# Altium schematic sheet 计算器.SchDoc
size A4
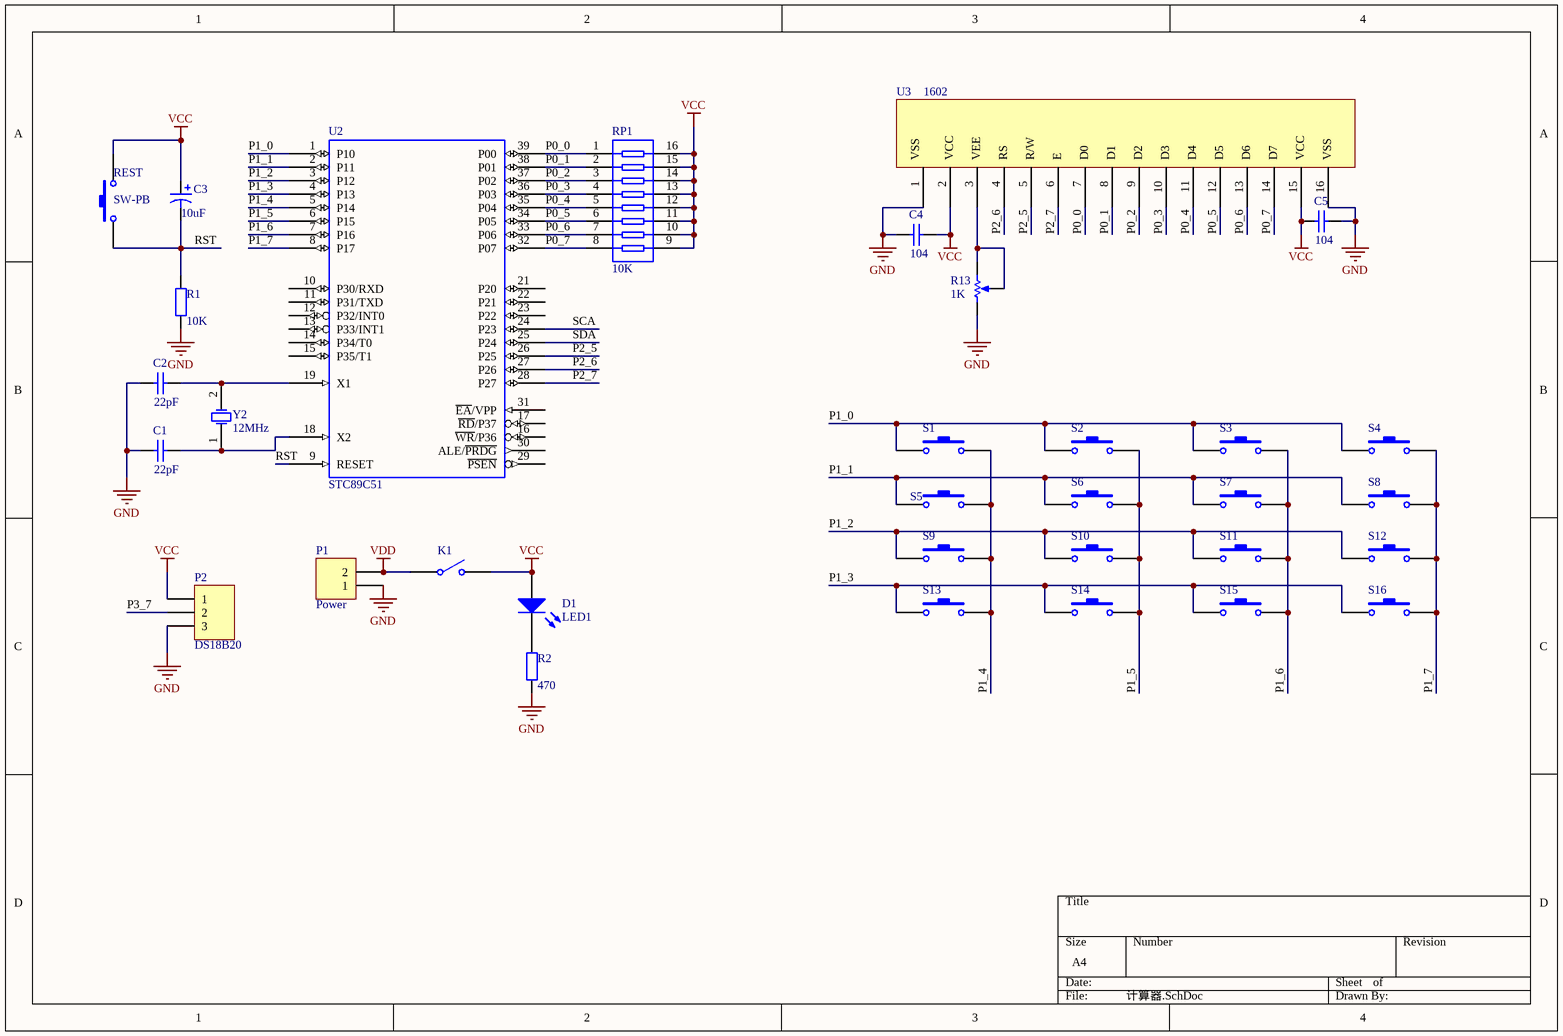
[diagram p0: 计算器.SchDoc]

## Parts
C1  value 22pF  [RAD-0.3]
C2  value 22pF  [RAD-0.3]
C3  value 10uF  [RB7.6-15]
C4  value 104  [RAD-0.3]
C5  value 104  [RAD-0.3]
D1  LED1  [LED-1]
K1  (no value)  [SPST-2]
P1  Power  [HDR1X2]
P2  DS18B20  [HDR1X3]
R1  value 10K  [AXIAL-0.4]
R2  value 470  [AXIAL-0.4]
R13  value 1K  [VR5]
REST  SW-PB  [SPST-2]
RP1  10K  [DIP16]
S1  (no value)  [SPST-2]
S2  (no value)  [SPST-2]
S3  (no value)  [SPST-2]
S4  (no value)  [SPST-2]
S5  (no value)  [SPST-2]
S6  (no value)  [SPST-2]
S7  (no value)  [SPST-2]
S8  (no value)  [SPST-2]
S9  (no value)  [SPST-2]
S10  (no value)  [SPST-2]
S11  (no value)  [SPST-2]
S12  (no value)  [SPST-2]
S13  (no value)  [SPST-2]
S14  (no value)  [SPST-2]
S15  (no value)  [SPST-2]
S16  (no value)  [SPST-2]
U2  STC89C51
U3  1602
Y2  12MHz  [BCY-W2/D3.1]

## Nets
GND: C1.1 C2.1 C4.1 C5.2 P1.1 P2.3 R1.1 R2.1 R13.1(TOP) U2.20(GND) U3.1 U3.16
VCC: C3.1 C4.2 C5.1 D1.1(A) K1.2(NO) P2.1 REST.2 RP1.9 RP1.10 RP1.11 RP1.12 RP1.13 RP1.14 RP1.15 RP1.16 U2.40(VCC) U3.2 U3.15
VDD: K1.1(COMMON) P1.2
P0_0: RP1.1 U2.39(P00) U3.7
P0_1: RP1.2 U2.38(P01) U3.8
P0_2: RP1.3 U2.37(P02) U3.9
P0_3: RP1.4 U2.36(P03) U3.10
P0_4: RP1.5 U2.35(P04) U3.11
P0_5: RP1.6 U2.34(P05) U3.12
P0_6: RP1.7 U2.33(P06)
P0_7: RP1.8 U2.32(P07)
P1_0: S1.1 S2.1 S3.1 S4.1 U2.1(P10)
P1_1: S5.1 S6.1 S7.1 S8.1 U2.2(P11)
P1_2: S9.1 S10.1 S11.1 S12.1 U2.3(P12)
P1_3: S13.1 S14.1 S15.1 S16.1 U2.4(P13)
P1_4: S1.2 S5.2 S9.2 S13.2 U2.5(P14)
P1_5: S2.2 S6.2 S10.2 S14.2 U2.6(P15)
P1_6: S3.2 S7.2 S11.2 S15.2 U2.7(P16)
P1_7: S4.2 S8.2 S12.2 S16.2 U2.8(P17)
P2_5: U2.26(P25)
P2_6: U2.27(P26)
P2_7: U2.28(P27)
P3_7: P2.2
RST: C3.2 R1.2 REST.1 U2.9(RESET)
SCA: U2.24(P23)
SDA: U2.25(P24)
NetC1_2: C1.2 U2.18(X2) Y2.1(OSC1)
NetC2_2: C2.2 U2.19(X1) Y2.2(OSC2)
NetD1_2: D1.2(K) R2.2
NetR13_2: R13.2(BOT) R13.3(TAP) U3.3

Not connected (* = marked no-connect by the designer): U2 10(P30/RXD) 11(P31/TXD) 12(P32/INT0) 13(P33/INT1) 14(P34/T0) 15(P35/T1) 16(~{WR}/P36) 17(~{RD}/P37) 21(P20) 22(P21) 23(P22) 29(~{PSEN}) 30(ALE/~{PRDG}) 31(~{EA}/VPP); U3 4 5 6 13 14

## Notes on the sheet
- P2_6
- P2_5
- P2_7
- P0_6
- P0_7
- (in symbol 1602) VSS; VCC; VEE; RS; R/W; E; D0; D1; D2; D3; D4; D5; D6; D7

## Library data of the parts
C1 C2 C4 C5 = Cap: Capacitor; Published: 8-Jun-2000; LatestRevisionDate: 17-Jul-2002; LatestRevisionNote: Re-released for DXP Platform.; PackageReference: RAD-0.3; Publisher: Altium Limited
C3 = Cap Pol1: Polarized Capacitor (Radial); Published: 8-Jun-2000; LatestRevisionDate: 17-Jul-2002; LatestRevisionNote: Re-released for DXP Platform.; PackageReference: RB7.6-15; Publisher: Altium Limited
D1 = LED1: Typical RED GaAs LED; Published: 8-Jun-2000; LatestRevisionDate: 08-Jul-2005; LatestRevisionNote: Mech Layer 1 removed.; PackageReference: LED-1; Publisher: Altium Limited
K1 = SW-SPST: Single-Pole, Single-Throw Switch; Published: 24-Mar-1999; LatestRevisionDate: 17-Jul-2002; LatestRevisionNote: Re-released for DXP Platform.; PackageReference: SPST-2; Publisher: Altium Limited
P1 = Header 2: Header, 2-Pin; LatestRevisionDate: 17-Jul-2002; LatestRevisionNote: Re-released for DXP Platform.; Publisher: Altium Limited
P2 = Header 3: Header, 3-Pin; LatestRevisionDate: 17-Jul-2002; LatestRevisionNote: Re-released for DXP Platform.; Publisher: Altium Limited
R1 R2 = Res2: Resistor; Published: 8-Jun-2000; LatestRevisionDate: 17-Jul-2002; LatestRevisionNote: Re-released for DXP Platform.; PackageReference: AXIAL-0.4; Publisher: Altium Limited
R13 = RPot: Potentiometer; Sim Note: Enter the Resistance value and the set point into parameter fields.; Set Position: 0.5; Published: 8-Jun-2000; LatestRevisionDate: 17-Jul-2002; LatestRevisionNote: Re-released for DXP Platform.; PackageReference: VR5; Publisher: Altium Limited
REST S1-S16 = SW-PB: Switch; Published: 24-Mar-1999; LatestRevisionDate: 17-Jul-2002; LatestRevisionNote: Re-released for DXP Platform.; PackageReference: SPST-2; Publisher: Altium Limited
RP1 = RESPACK4
U2 = AT89C51
Y2 = XTAL: Crystal Oscillator; Published: 8-Jun-2000; LatestRevisionDate: 17-Jul-2002; LatestRevisionNote: Re-released for DXP Platform.; PackageReference: R38; Publisher: Altium Limited